# EAGLE board BigMuff (EAGLE 7.1.0)
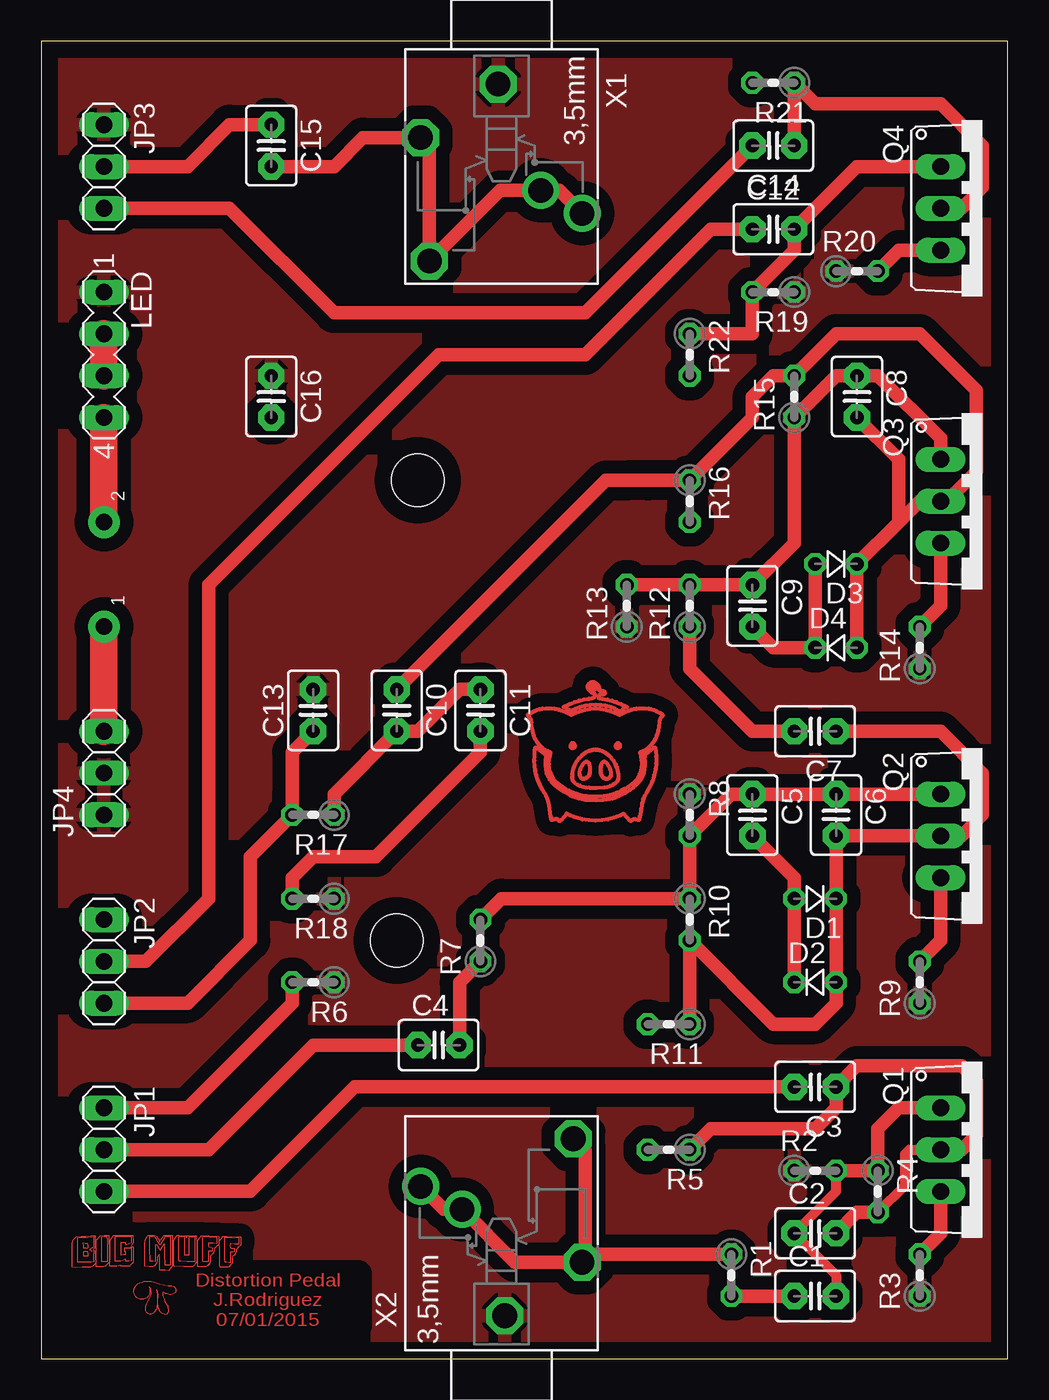
[diagram p1: board, top side]
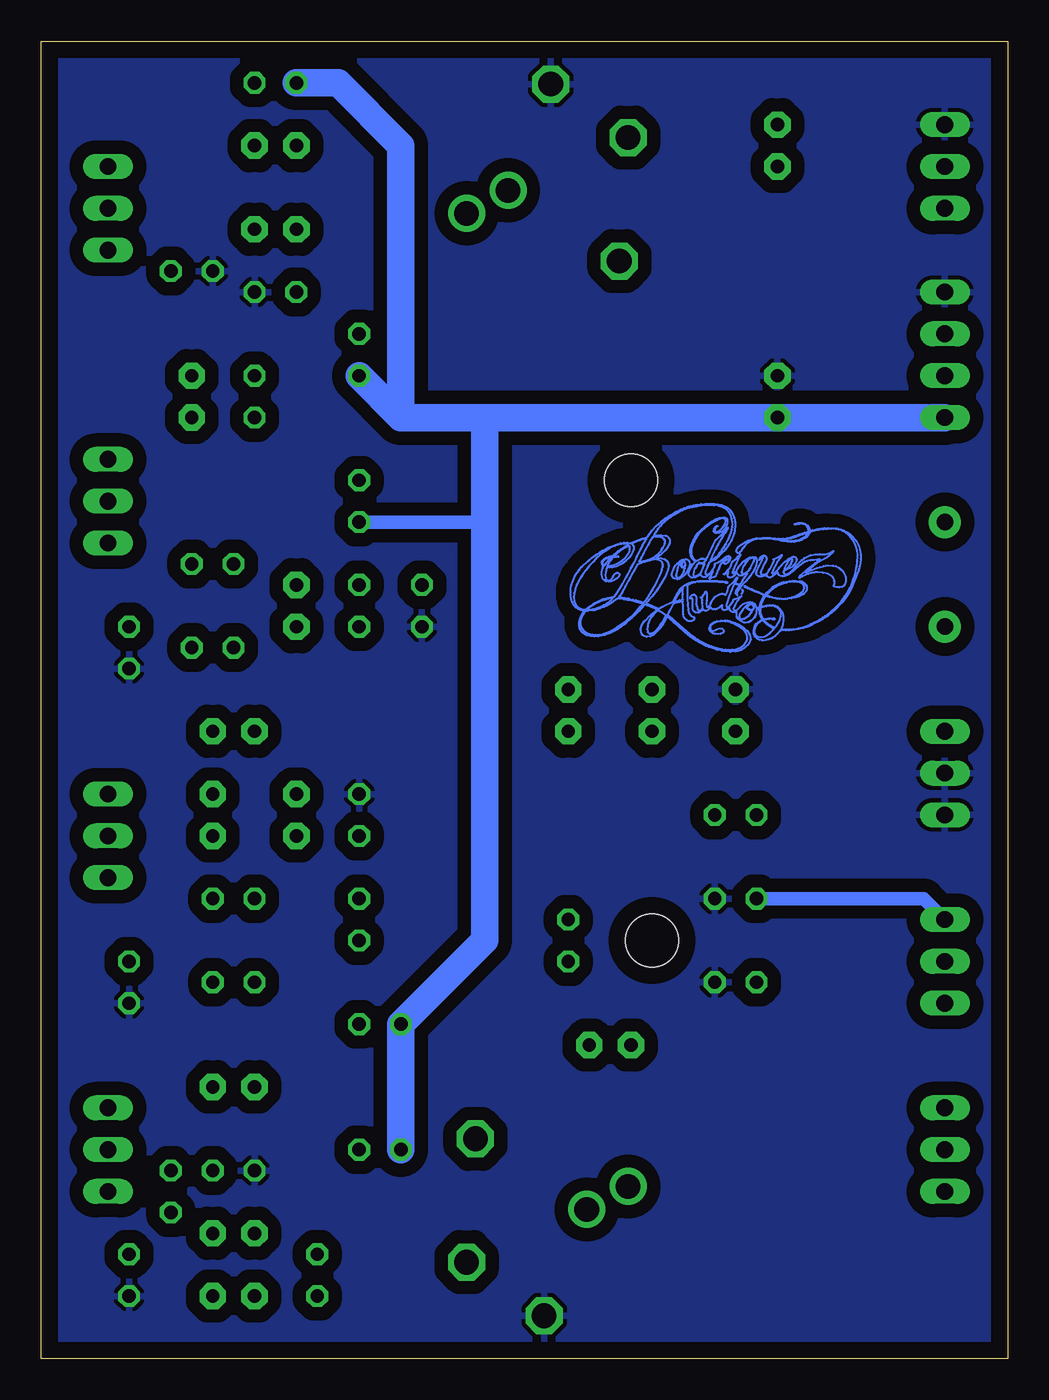
[diagram p2: board, bottom side, seen from below]

Size 58.67 x 80 mm. Coordinates in mm from the lower left corner, seen from the top.
Outline: 0,0 58.67,0 58.67,80 0,80 0,0
Copper layers (1*16): Top 0.035mm / dielectric 1.5mm / Bottom 0.035mm
Design rules "default": minimum track width 10mil, minimum drill 24mil, track to track 8mil, track to pad 8mil, pad to pad 8mil, via to via 8mil, smd to smd 8mil, copper to edge 40mil, drill to drill 8mil, minimum pad ring 10mil, minimum via ring 8mil, stop-mask expansion 4mil, vias tented up to drill 0mil, thermal gap 10mil
Holes 3.2 mm at 22.86,53.34 21.59,25.4

## Footprints (pad centres in the part's own frame; a part is rotated, then mirrored left to right if it is on the bottom)
C2.5-3 = drill 0.813 pad 1.6 octagon: 1 -1.27,0; 2 1.27,0
D-2.5 = drill 0.813 octagon: A 1.27,0; C -1.27,0
1X03 = drill 1.016 long: 1 -2.54,0; 2 0,0; 3 2.54,0
MA04-1 = drill 1.016 long: 1 -3.81,0; 2 -1.27,0; 3 1.27,0; 4 3.81,0
TO220AV = drill 1.016 long: B -2.54,-2.54; C 0,-2.54; E 2.54,-2.54
0204V = drill 0.813 octagon: 1 -1.27,0; 2 1.27,0
MOMENTARY_SWITCH = drill 1 pad 1.93: 1 0,0; 2 6.35,0
PG203J = drill 1.499 octagon: 1 -5.004,-0.203; 4 5.74,-4.369; 5 -1.753,-4.902 | drill 1.499: 2 2.845,4.902; 3 1.448,2.388

## Placement (x,y rotation side)
C1  [C2.5-3]  46.99,3.81 0 top
C2  [C2.5-3]  46.99,7.62 0 top
C3  [C2.5-3]  46.99,16.51 180 top
C4  [C2.5-3]  24.13,19.05 0 top
C5  [C2.5-3]  43.18,33.02 270 top
C6  [C2.5-3]  48.26,33.02 270 top
C7  [C2.5-3]  46.99,38.1 180 top
C8  [C2.5-3]  49.53,58.42 270 top
C9  [C2.5-3]  43.18,45.72 270 top
C10  [C2.5-3]  21.59,39.37 270 top
C11  [C2.5-3]  26.67,39.37 270 top
C12  [C2.5-3]  44.45,68.58 0 top
C13  [C2.5-3]  16.51,39.37 90 top
C14  [C2.5-3]  44.45,73.66 180 top
C15  [C2.5-3]  13.97,73.66 270 top
C16  [C2.5-3]  13.97,58.42 270 top
D1  [D-2.5]  46.99,27.94 180 top
D2  [D-2.5]  46.99,22.86 0 top
D3  [D-2.5]  48.26,48.26 180 top
D4  [D-2.5]  48.26,43.18 0 top
JP1  [1X03]  3.81,12.7 270 top
JP2  [1X03]  3.81,24.13 270 top
JP3  [1X03]  3.81,72.39 270 top
JP4  [1X03]  3.81,35.56 90 top
LED  [MA04-1]  3.81,60.96 270 top
Q1  TIP41C  [TO220AV]  57.15,12.7 270 top
Q2  TIP41C  [TO220AV]  57.15,31.75 270 top
Q3  TIP41C  [TO220AV]  57.15,52.07 270 top
Q4  TIP41C  [TO220AV]  57.15,69.85 270 top
R1  [0204V]  41.91,5.08 270 top
R2  [0204V]  46.99,11.43 0 top
R3  [0204V]  53.34,5.08 90 top
R4  [0204V]  50.8,10.16 270 top
R5  [0204V]  38.1,12.7 180 top
R6  [0204V]  16.51,22.86 180 top
R7  [0204V]  26.67,25.4 90 top
R8  [0204V]  39.37,33.02 270 top
R9  [0204V]  53.34,22.86 90 top
R10  [0204V]  39.37,26.67 270 top
R11  [0204V]  38.1,20.32 180 top
R12  [0204V]  39.37,45.72 90 top
R13  [0204V]  35.56,45.72 90 top
R14  [0204V]  53.34,43.18 90 top
R15  [0204V]  45.72,58.42 90 top
R16  [0204V]  39.37,52.07 270 top
R17  [0204V]  16.51,33.02 180 top
R18  [0204V]  16.51,27.94 180 top
R19  [0204V]  44.45,64.77 180 top
R20  [0204V]  49.53,66.04 0 top
R21  [0204V]  44.45,77.47 180 top
R22  [0204V]  39.37,60.96 270 top
SWITCH  MOMENTARY_SWITCH  [MOMENTARY_SWITCH]  3.81,44.45 90 top
X1  PG203J  [PG203J]  27.94,72.39 270 top
X2  PG203J  [PG203J]  27.94,7.62 90 top

## Tracks (layer width: path | path; a pad name or v marks a point on that pad's centre or on a via)
GND
  pour Bottom (isolate 0.813): -2.54,-1.27 -2.54,81.28 59.69,81.28 59.69,-1.27
  pour Top (isolate 0.813): 0,81.28 59.69,81.28 59.69,-1.27 -1.27,-1.27 -1.27,81.28
N$1
  Top 0.61: R4.2 52.45,10.54 52.45,12.45 52.7,12.7 Q1.C
  Top 0.813: C2.2 49.53,8.89 R4.2 | Q1.C 55.88,12.7 56.77,13.59 56.77,16.89 55.88,17.78 49.53,17.78 C3.1 48.26,15.24 46.99,13.97 40.64,13.97 R5.1
N$2
  Top 0.61: R2.2 48.26,10.16 C2.1 48.26,5.08 C1.2
  Top 0.813: Q1.B 52.07,15.24 50.8,13.97 R4.1 R2.2
N$3
  Top 0.813: R1.2 C1.1
N$4
  Top 1.676: JP4.3 SWITCH.1
N$5
  Top 0.813: R3.2 54.61,7.62 Q1.E
N$6
  Top 0.813: JP1.3 12.7,10.16 19.05,16.51 C3.2
N$7
  Top 0.813: JP1.1 8.89,15.24 15.24,21.59 R6.2
N$8
  Top 0.813: Q4.C 55.88,69.85 57.15,71.12 57.15,73.66 54.61,76.2 46.99,76.2 R21.1 C14.1
N$9
  Top 0.813: JP1.2 10.16,12.7 16.51,19.05 C4.1
N$10
  Top 0.813: C7.1 54.61,38.1 57.15,35.56 57.15,33.02 55.88,31.75 Q2.C C6.2 D1.C D2.A 48.26,21.59 46.99,20.32 44.45,20.32 R10.2 R11.1
N$11
  Top 0.813: C5.2 45.72,29.21 D1.A D2.C
N$12
  Top 0.813: Q2.B C6.1 C5.1 41.91,34.29 R8.2 R10.1 27.94,27.94 R7.2
N$13
  Top 0.813: R9.2 54.61,25.4 Q2.E
N$14
  Top 0.813: R12.1 39.37,41.91 43.18,38.1 C7.2
N$15
  Top 0.813: R7.1 25.4,22.86 C4.2
N$16
  Top 0.813: X1.2 31.44,70.94 X1.3 27.86,70.94 X1.4 23.57,73.61 X1.5 19.53,74.14 17.78,72.39 C15.2
N$17
  Top 0.813: D4.A D3.C 52.07,50.8 | 52.07,50.8 53.34,52.07 Q3.C 54.99,52.07 56.77,53.85 56.77,58.8 53.34,62.23 48.26,62.23 R15.2 44.45,59.69 43.18,58.42 43.18,57.15 R16.1 36.83,53.34 35.56,53.34 34.29,53.34 C10.1 | C8.2 52.07,54.61 52.07,50.8
N$18
  Top 0.813: Q3.B 54.61,55.88 50.8,59.69 C8.1 48.26,59.69 R15.1 45.72,49.53 C9.1 R12.2 R13.2
N$19
  Top 0.813: R14.2 54.61,45.72 Q3.E
N$20
  Top 0.813: D3.A D4.C 44.45,43.18 C9.2
N$21
  Top 0.813: C13.1 15.24,36.83 15.24,34.29 R17.2 12.7,30.48 12.7,25.4 8.89,21.59 JP2.3
N$22
  Bottom 0.127: 16.86,42.92 17.24,42.96 17.35,42.98 17.62,43.05 17.71,43.07 18.17,43.23 18.3,43.29 18.37,43.32 18.43,43.35 18.57,43.42 18.69,43.48 18.89,43.6 19.13,43.75 19.22,43.82 19.44,43.99 19.57,44.1 19.69,44.2 19.93,44.41 20.27,44.72 20.49,44.92 20.55,44.97 20.65,45.06 20.68,45.06 20.7,45.03 20.74,44.96 20.76,44.91 20.78,44.88 20.88,44.71 20.89,44.67 20.92,44.62 21.03,44.47 21.09,44.39 21.13,44.34 21.16,44.3 21.26,44.19 21.38,44.05 21.44,44 21.5,43.95 21.68,43.86 21.92,43.84 22.07,43.88 22.15,43.94 22.21,44.02 22.24,44.12 22.26,44.24 22.26,44.36 22.2,44.54 22.15,44.64 22.05,44.77 22.01,44.82 21.74,45.1 21.64,45.18 21.53,45.28 21.39,45.38 21.3,45.45 21.29,45.46 21.3,45.48 21.47,45.57 21.54,45.61 21.64,45.66 21.75,45.7 21.82,45.73 21.87,45.75 21.89,45.75 21.99,45.79 22.04,45.79 22.07,45.77 22.23,45.59 22.4,45.4 22.53,45.26 22.65,45.14 22.8,44.98 23.17,44.66 23.27,44.59 23.45,44.45 23.5,44.42 23.69,44.3 23.76,44.26 23.81,44.22 23.84,44.21 23.95,44.15 24.11,44.08 24.45,43.94 24.83,43.86 25.08,43.85 25.31,43.87 25.52,43.93 25.67,43.99 25.8,44.09 25.9,44.2 25.97,44.32 26.01,44.52 26.01,44.73 25.98,44.87 25.93,44.99 25.82,45.2 25.72,45.36 25.69,45.4 25.7,45.41 25.75,45.42 25.92,45.46 26.08,45.53 26.23,45.63 26.35,45.76 26.44,45.92 26.5,46.12 26.53,46.32 26.53,46.51 26.52,46.74 26.48,46.98 26.43,47.13 26.38,47.27 26.25,47.56 26.11,47.76 26,47.9 25.84,48.08 25.48,48.43 25.41,48.49 25.23,48.64 25.11,48.73 24.99,48.82 24.73,48.98 24.69,49 24.64,49.03 24.59,49.07 24.36,49.19 24.3,49.23 24.27,49.24 24.12,49.3 23.84,49.41 23.69,49.46 23.49,49.52 23.28,49.55 23.08,49.55 22.91,49.52 22.87,49.51 22.83,49.53 22.74,49.57 22.54,49.66 22.14,49.81 21.9,49.88 21.84,49.92 21.73,50.09 21.7,50.14 21.63,50.23 21.56,50.31 21.32,50.58 21.03,50.83 20.92,50.91 20.81,51 20.75,51.04 20.58,51.16 20.47,51.23 20.27,51.34 20.22,51.37 20.16,51.4 20.09,51.44 19.87,51.55 19.64,51.64 19.47,51.71 19.36,51.74 19.25,51.77 19.11,51.8 19.03,51.82 18.95,51.83 18.88,51.85 18.6,51.89 18.36,51.91 17.79,51.91 17.55,51.87 17.4,51.84 17.26,51.81 17.09,51.72 17,51.66 16.96,51.64 16.86,51.55 16.73,51.36 16.68,51.27 16.66,51.22 16.6,51.06 16.54,50.77 16.54,50.54 16.55,50.37 16.57,50.25 16.6,50.13 16.65,49.96 16.76,49.72 16.81,49.62 16.87,49.51 16.89,49.48 16.95,49.38 17,49.31 17.04,49.26 17.08,49.21 17.14,49.12 17.2,49.05 17.53,48.71 17.63,48.63 17.71,48.57 17.78,48.51 17.95,48.43 18.12,48.34 18.15,48.27 18.19,48.18 18.2,48.15 18.21,48.13 18.29,47.92 18.31,47.86 18.34,47.76 18.34,47.66 18.31,47.63 18.28,47.61 18.17,47.64 18.07,47.71 17.97,47.8 17.87,47.93 17.79,48.06 17.77,48.15 17.77,48.22 17.79,48.25 17.8,48.26 17.77,48.28 17.55,48.37 17.37,48.47 17.25,48.57 17.14,48.67 17.05,48.72 16.97,48.74 16.91,48.74 16.87,48.72 16.85,48.68 16.85,48.61 16.88,48.5 16.98,48.36 17.05,48.29 17.1,48.27 17.17,48.27 17.21,48.29 17.22,48.35 17.2,48.43 17.08,48.53 17.03,48.53 16.99,48.52 16.97,48.52 16.95,48.52 16.89,48.63 16.89,48.66 16.91,48.69 16.98,48.69 17.07,48.65 17.14,48.59 17.25,48.47 17.4,48.27 17.45,48.19 17.49,48.11 17.52,48.03 17.58,47.88 17.67,47.67 17.71,47.53 17.73,47.49 17.79,47.48 17.96,47.42 18.03,47.38 18.08,47.36 18.1,47.35 18.1,47.36 18.05,47.46 18,47.56 17.99,47.58 17.89,47.8 17.9,47.8 17.92,47.77 17.97,47.74 18.04,47.68 18.21,47.54 18.3,47.48 18.38,47.46 18.47,47.46 18.53,47.48 18.59,47.53 18.62,47.6 18.63,47.63 18.69,47.6 18.75,47.55 18.93,47.46 18.97,47.45 19.09,47.43 19.19,47.43 19.24,47.46 19.32,47.53 19.36,47.6 19.36,47.67 19.35,47.76 19.28,47.95 19.24,48.01 19.2,48.08 19.17,48.13 19.2,48.16 19.26,48.17 19.3,48.16 19.32,48.11 19.36,48 19.41,47.9 19.47,47.79 19.52,47.72 19.61,47.61 19.7,47.53 19.81,47.43 19.93,47.36 20.03,47.33 20.22,47.36 20.3,47.42 20.36,47.48 20.38,47.57 20.38,47.69 20.34,47.83 20.28,47.98 20.24,48.06 20.15,48.17 20.07,48.27 19.95,48.38 19.88,48.43 19.79,48.49 19.69,48.53 19.56,48.55 19.45,48.53 19.37,48.47 19.32,48.41 19.29,48.27 19.29,48.23 19.24,48.23 19.2,48.22 19.17,48.2 19.14,48.19 19.11,48.22 19.07,48.26 18.96,48.39 19.02,48.44 19.13,48.56 19.21,48.69 19.24,48.79 19.26,48.98 19.25,49.15 19.23,49.26 19.19,49.42 19.13,49.6 19.09,49.68 19.06,49.75 19.03,49.79 18.95,49.92 18.78,50.14 18.65,50.28 18.55,50.37 18.44,50.46 18.35,50.54 18.28,50.6 18.21,50.67 18.13,50.73 18.05,50.77 17.96,50.83 17.74,50.96 17.71,50.98 17.51,51.05 17.25,51.09 17.16,51.07 17.08,51.02 17.03,50.95 17,50.85 17.02,50.72 17.05,50.63 17.09,50.54 17.19,50.37 17.2,50.34 17.29,50.26 17.4,50.19 17.52,50.14 17.64,50.13 17.7,50.13 17.73,50.14 17.77,50.16 17.81,50.18 17.84,50.23 17.85,50.28 17.82,50.41 17.73,50.53 17.67,50.56 17.62,50.58 17.6,50.58 17.6,50.56 17.66,50.51 17.72,50.46 17.76,50.41 17.78,50.34 17.78,50.29 17.74,50.22 17.66,50.21 17.57,50.24 17.48,50.28 17.35,50.4 17.26,50.51 17.24,50.55 17.15,50.7 17.11,50.88 17.12,50.97 17.14,50.99 17.17,51.01 17.24,51.03 17.31,51.03 17.52,50.98 17.93,50.77 18,50.73 18.12,50.64 18.25,50.54 18.33,50.48 18.4,50.43 18.59,50.25 18.77,50.05 18.98,49.73 19.03,49.63 19.07,49.55 19.14,49.37 19.19,49.17 19.2,49 19.19,48.84 19.11,48.64 19.02,48.54 18.93,48.46 18.9,48.44 18.88,48.44 18.81,48.48 18.69,48.54 18.61,48.58 18.55,48.59 18.46,48.59 18.39,48.55 18.34,48.5 18.31,48.48 18.23,48.65 18.12,48.89 18.1,48.92 18.07,48.98 17.96,49.2 17.89,49.36 17.76,49.66 17.73,49.71 17.7,49.73 17.65,49.77 17.43,49.96 17.38,50.02 17.17,50.25 17.11,50.33 17.05,50.4 17.02,50.43 17,50.45 16.97,50.47 16.96,50.45 16.99,50.41 17.04,50.33 17.09,50.26 17.18,50.13 17.22,50.06 17.3,49.92 17.34,49.86 17.37,49.8 17.4,49.75 17.44,49.69 17.47,49.64 17.48,49.62 17.5,49.57 17.57,49.46 17.62,49.36 17.63,49.34 17.66,49.28 17.7,49.21 17.74,49.12 17.83,48.95 17.91,48.77 17.96,48.67 18,48.56 18.05,48.47 17.99,48.49 17.93,48.53 17.75,48.64 17.54,48.83 17.44,48.97 17.43,48.98 17.39,49.02 17.34,49.08 17.2,49.29 17.11,49.45 16.95,49.75 16.95,49.77 16.92,49.83 16.88,49.92 16.85,49.98 16.78,50.2 16.74,50.32 16.71,50.49 16.7,50.69 16.7,50.83 16.74,50.99 16.81,51.22 16.94,51.43 17.07,51.57 17.14,51.62 17.33,51.71 17.55,51.78 17.82,51.82 18.11,51.83 18.33,51.83 18.78,51.77 18.87,51.75 18.97,51.74 19.04,51.73 19.17,51.7 19.31,51.67 19.51,51.6 19.71,51.52 19.74,51.51 19.97,51.4 20.06,51.34 20.28,51.22 20.32,51.2 20.44,51.12 20.5,51.08 20.65,50.96 20.66,50.95 20.75,50.88 20.8,50.84 20.86,50.79 20.99,50.67 21.09,50.56 21.17,50.47 21.21,50.41 21.24,50.37 21.33,50.24 21.39,50.14 21.47,50 21.47,49.99 21.32,50 21.06,50.01 20.77,49.99 20.7,49.96 20.66,49.94 20.55,49.81 20.53,49.78 20.51,49.74 20.5,49.65 20.52,49.53 20.6,49.36 20.63,49.29 20.81,49.07 21.04,48.84 21.09,48.8 21.15,48.75 21.21,48.71 21.26,48.67 21.3,48.64 21.24,48.64 21.03,48.61 20.83,48.55 20.78,48.53 20.7,48.46 20.62,48.37 20.61,48.33 20.59,48.27 20.57,48.23 20.57,48.15 20.59,48 20.65,47.79 20.68,47.71 20.71,47.64 20.79,47.47 20.84,47.38 20.9,47.29 20.92,47.24 21.02,47.08 21.07,46.99 21.18,46.83 21.22,46.78 21.28,46.7 21.38,46.55 21.48,46.42 21.61,46.26 21.75,46.11 21.86,45.98 21.88,45.95 21.93,45.89 21.86,45.84 21.78,45.8 21.56,45.71 21.5,45.68 21.36,45.62 21.18,45.54 21.14,45.56 21.06,45.61 20.94,45.67 20.73,45.78 20.45,45.9 20.33,45.95 20.29,46 20.15,46.28 20.08,46.4 20.03,46.5 19.97,46.59 19.89,46.71 19.8,46.82 19.69,46.91 19.56,46.99 19.33,47.11 19.18,47.16 19.09,47.17 18.82,47.22 18.69,47.23 18.1,47.24 17.58,47.23 17.27,47.21 17.12,47.19 17.03,47.17 17.01,47.14 17.02,47.1 17.06,47.1 17.14,47.11 17.54,47.16 18.01,47.19 18.38,47.19 18.74,47.18 18.96,47.14 19.16,47.09 19.35,47.01 19.46,46.94 19.44,46.16 19.42,45.76 19.39,45.49 19.38,45.41 19.33,45.25 19.24,45.12 19.17,45.07 19.1,45.05 19.04,45.03 19.02,45.01 19.02,44.98 19.04,44.93 19.08,44.86 19.15,44.81 19.2,44.79 19.28,44.78 19.38,44.79 19.47,44.84 19.57,44.92 19.65,45.05 19.68,45.19 19.7,45.4 19.7,45.68 19.72,45.98 19.91,45.94 20.04,45.91 20.29,45.84 20.35,45.73 20.41,45.62 20.44,45.55 20.47,45.51 20.5,45.45 20.59,45.29 20.63,45.19 20.59,45.13 20.53,45.08 20.42,44.99 20.35,44.93 20.19,44.79 20.15,44.76 20.01,44.64 19.97,44.6 19.91,44.53 19.84,44.47 19.79,44.44 19.73,44.39 19.65,44.32 19.57,44.25 19.49,44.19 19.35,44.07 19.05,43.84 18.99,43.79 18.8,43.66 18.57,43.53 18.5,43.49 18.3,43.39 18.2,43.35 18.09,43.31 17.98,43.27 17.67,43.16 17.44,43.11 17.35,43.09 17.12,43.06 16.71,43.06 16.51,43.08 16.43,43.1 16.37,43.12 16.22,43.18 16.1,43.25 15.99,43.36 15.91,43.47 15.85,43.55 15.8,43.7 15.8,43.84 15.82,43.95 15.86,44.04 15.91,44.13 15.99,44.22 16.2,44.39 16.22,44.4 16.3,44.45 16.4,44.52 16.56,44.6 16.71,44.66 16.83,44.71 17.01,44.75 17.13,44.77 17.31,44.78 17.47,44.78 17.59,44.75 17.72,44.71 17.87,44.65 17.95,44.58 18.01,44.51 18.05,44.43 18.06,44.35 18.04,44.29 18.01,44.24 17.96,44.2 17.91,44.18 17.84,44.19 17.74,44.24 17.58,44.32 17.46,44.35 17.33,44.33 17.25,44.26 17.23,44.2 17.23,44.15 17.27,44.1 17.33,44.05 17.44,44.01 17.58,44 17.75,44.01 17.88,44.04 18,44.12 18.07,44.2 18.09,44.24 18.11,44.32 18.09,44.41 18.06,44.5 17.99,44.6 17.9,44.68 17.79,44.74 17.65,44.79 17.41,44.83 17.18,44.83 17.11,44.82 17.02,44.81 16.9,44.8 16.73,44.75 16.51,44.67 16.32,44.59 16.01,44.38 15.96,44.34 15.82,44.19 15.66,43.95 15.61,43.81 15.61,43.7 15.62,43.59 15.68,43.47 15.77,43.34 15.94,43.18 15.99,43.15 16.16,43.05 16.28,43 16.39,42.97 16.52,42.95 16.82,42.92 16.86,42.92
  Bottom 0.127: 16.86,42.92
N$23
  Top 0.813: R17.1 17.78,34.29 C10.2 22.86,38.1 25.4,40.64 C11.1
N$24
  Top 0.813: JP2.2 6.35,24.13 10.16,27.94 10.16,46.99 24.13,60.96 33.02,60.96 40.64,68.58 C12.1
N$25
  Bottom 0.127: 24.75,43.97 24.57,44 24.46,44.03 24.36,44.07 24.13,44.17 24.03,44.23 23.94,44.28 23.83,44.34 23.71,44.42 23.62,44.48 23.52,44.54 23.44,44.6 23.39,44.63 23.33,44.68 23.23,44.75 23.15,44.82 23.1,44.86 23.04,44.91 22.72,45.19 22.64,45.28 22.55,45.37 22.38,45.55 22.26,45.68 22.16,45.79 22.15,45.83 22.29,45.88 22.62,45.97 22.84,46.03 23,46.06 23.09,46.08 23.18,46.09 23.29,46.11 23.66,46.16 23.71,46.15 23.8,46.08 24.04,45.9 24.11,45.85 24.29,45.75 24.38,45.7 24.44,45.67 24.51,45.65 24.74,45.56 25.05,45.46 25.13,45.44 25.46,45.41 25.55,45.41 25.61,45.39 25.65,45.35 25.72,45.25 25.78,45.17 25.82,45.11 25.85,45.05 25.95,44.79 25.95,44.63 25.93,44.5 25.91,44.45 25.86,44.35 25.77,44.24 25.67,44.15 25.55,44.07 25.4,44.01 25.2,43.97 25.09,43.96 24.75,43.97
N$26
  Top 0.813: Q4.B 49.53,72.39 C12.2 45.72,67.31 R19.2 43.18,62.23 R22.1
N$27
  Top 0.813: R18.2 15.24,29.21 16.51,30.48 20.32,30.48 26.67,36.83 C11.2
  Bottom 0.813: JP2.1 5.08,27.94 R18.2
N$28
  Top 0.813: R20.2 52.07,67.31 Q4.E
N$29
  Top 0.813: JP3.3 11.43,69.85 17.78,63.5 33.02,63.5 C14.2
N$30
  Bottom 0.127: 21.59,44.05 21.47,44.1 21.34,44.21 21.19,44.38 21.14,44.46 21.11,44.5 21.08,44.55 21.02,44.62 20.99,44.68 20.95,44.74 20.91,44.8 20.87,44.87 20.8,45 20.74,45.12 20.74,45.14 20.77,45.16 20.85,45.22 20.92,45.27 21.02,45.33 21.11,45.38 21.17,45.42 21.21,45.43 21.26,45.41 21.32,45.36 21.36,45.33 21.4,45.3 21.44,45.27 21.61,45.06 21.66,44.99 21.7,44.93 21.73,44.86 21.8,44.71 21.84,44.58 21.86,44.48 21.88,44.31 21.85,44.13 21.81,44.07 21.74,44.04 21.68,44.02 21.59,44.05
N$31
  Top 0.813: X2.2 24.44,9.07 X2.3 28.75,5.87 X2.5 | X2.5 33.33,6.35 R1.1 | X2.4 33.02,12.65 33.02,6.35 32.84,6.17 X2.5
N$32
  Top 0.813: JP3.2 8.89,72.39 11.43,74.93 C15.1
N$33
  Top 1.676: LED.3 LED.2
N$34
  Bottom 0.127: 25.55,45.54 25.46,45.62 25.39,45.67 25.16,45.83 25.11,45.85 25.05,45.89 24.98,45.93 24.54,46.13 24.27,46.21 23.97,46.26 23.89,46.28 23.76,46.42 23.53,46.77 23.38,47.05 23.28,47.23 23.2,47.38 23.14,47.48 23.11,47.54 23.08,47.59 23.04,47.67 22.95,47.84 22.94,47.87 22.91,47.91 22.89,47.96 22.87,48 22.81,48.09 22.78,48.15 22.73,48.24 22.68,48.34 22.65,48.4 22.59,48.52 22.51,48.69 22.46,48.78 22.38,48.95 22.37,48.98 22.34,49.03 22.31,49.09 22.29,49.12 22.27,49.16 22.23,49.24 22.21,49.3 22.17,49.36 22.13,49.42 22.07,49.54 22.04,49.59 22.02,49.64 21.99,49.67 21.96,49.73 21.94,49.78 21.95,49.79 22.32,49.69 22.75,49.5 22.79,49.47 22.75,49.4 22.7,49.31 22.69,49.24 22.7,49.14 22.72,49.07 22.76,48.99 22.85,48.81 22.96,48.67 23.02,48.6 23.18,48.44 23.26,48.38 23.32,48.33 23.38,48.29 23.46,48.24 23.52,48.22 23.67,48.14 23.78,48.1 23.92,48.07 24.02,48.05 24.17,48.06 24.32,48.06 24.34,48 24.39,47.78 24.42,47.59 24.39,47.37 24.39,47.34 24.36,47.3 24.3,47.27 24.23,47.25 24.19,47.24 24.14,47.26 24.07,47.32 24.01,47.39 23.96,47.46 23.91,47.55 23.86,47.63 23.8,47.69 23.75,47.72 23.69,47.73 23.6,47.69 23.56,47.66 23.55,47.63 23.61,47.49 23.71,47.39 23.85,47.3 24.04,47.22 24.12,47.2 24.23,47.19 24.37,47.2 24.4,47.21 24.49,47.26 24.57,47.35 24.62,47.48 24.65,47.62 24.64,47.76 24.61,47.91 24.56,48.02 24.51,48.13 24.54,48.16 24.62,48.25 24.64,48.35 24.62,48.44 24.56,48.51 24.5,48.56 24.34,48.65 24.21,48.7 24.07,48.73 23.98,48.74 23.95,48.78 23.7,48.99 23.64,49.03 23.58,49.08 23.47,49.16 23.32,49.26 23.18,49.35 23.1,49.4 23.06,49.42 23.05,49.45 23.1,49.47 23.3,49.48 23.44,49.48 23.53,49.46 23.85,49.36 24.12,49.23 24.19,49.19 24.43,49.04 24.61,48.91 24.75,48.79 24.8,48.74 24.87,48.69 24.97,48.59 25.18,48.38 25.27,48.28 25.34,48.2 25.39,48.14 25.62,47.87 25.67,47.8 25.7,47.77 25.73,47.73 25.75,47.69 25.79,47.64 25.89,47.48 25.97,47.35 26,47.31 26.03,47.25 26.13,47.04 26.16,46.99 26.24,46.76 26.26,46.69 26.29,46.57 26.31,46.47 26.34,46.25 26.32,45.98 26.26,45.85 26.24,45.8 26.15,45.7 26.08,45.63 26,45.58 25.88,45.53 25.72,45.49 25.62,45.49 25.55,45.54
  Bottom 0.127: 25.55,45.54
N$35
  Bottom 0.127: 25.17,45.52 24.82,45.62 24.52,45.76 24.31,45.88 24.21,45.95 24.09,46.05 23.99,46.15 24,46.16 24.34,46.11 24.42,46.09 24.48,46.07 24.5,46.07 24.61,46.04 24.7,46 24.83,45.94 25.02,45.85 25.17,45.76 25.28,45.69 25.44,45.57 25.51,45.5 25.49,45.49 25.41,45.48 25.31,45.49 25.17,45.52
N$36
  Bottom 0.127: 22.05,45.94 22.01,45.99 21.92,46.12 21.86,46.21 21.77,46.33 21.7,46.44 21.67,46.48 21.65,46.52 21.57,46.66 21.48,46.81 21.44,46.9 21.4,46.96 21.29,47.19 21.12,47.55 21.1,47.61 21.07,47.67 21.04,47.74 21.01,47.84 20.99,47.89 20.93,48.08 20.92,48.18 20.93,48.23 20.96,48.32 20.99,48.38 21.03,48.44 21.2,48.52 21.27,48.54 21.47,48.54 21.56,48.52 21.63,48.5 21.71,48.48 21.78,48.46 21.85,48.44 21.96,48.41 22.03,48.39 22.22,48.32 22.32,48.28 22.45,48.24 22.51,48.18 22.56,48.07 22.6,47.99 22.63,47.93 22.72,47.78 22.76,47.7 22.8,47.62 22.84,47.55 22.88,47.48 22.91,47.43 22.95,47.37 23.02,47.23 23.21,46.89 23.31,46.7 23.33,46.65 23.37,46.6 23.47,46.44 23.54,46.34 23.59,46.28 23.6,46.26 23.57,46.24 23.52,46.23 23.47,46.23 23.4,46.22 23.24,46.2 23.07,46.17 22.99,46.15 22.73,46.1 22.56,46.06 22.41,46.02 22.31,45.99 22.23,45.96 22.15,45.93 22.08,45.91 22.05,45.94 | 22.05,45.94
N$37
  Bottom 0.127: 20.1,46.01 19.9,46.06 19.78,46.09 19.72,46.12 19.71,46.44 19.71,46.77 19.75,46.75 19.83,46.68 19.91,46.58 19.98,46.46 20.03,46.37 20.06,46.32 20.09,46.26 20.13,46.2 20.16,46.15 20.2,46.08 20.23,46.01 20.24,45.99 20.23,45.98 20.1,46.01 | 20.1,46.01
N$38
  Bottom 0.127: 19.92,47.44 19.75,47.61 19.65,47.78 19.59,47.99 19.59,48.06 19.6,48.07 19.62,48.06 19.72,48.04 19.77,48.06 19.79,48.08 19.82,48.12 19.83,48.18 19.81,48.28 19.78,48.36 19.74,48.43 19.84,48.37 19.9,48.31 19.95,48.24 20.02,48.06 20.03,48.03 20.05,47.95 20.07,47.88 20.11,47.68 20.12,47.59 20.12,47.52 20.09,47.46 20.06,47.44 20,47.42 19.92,47.44
N$39
  Bottom 0.127: 18.92,47.53 18.79,47.59 18.66,47.68 18.62,47.72 18.6,47.77 18.57,47.85 18.52,47.97 18.44,48.14 18.4,48.23 18.4,48.25 18.51,48.26 18.75,48.28 18.79,48.28 18.83,48.24 18.88,48.15 18.98,48.01 19.02,47.93 19.04,47.82 19.07,47.61 19.06,47.55 19.03,47.52 18.99,47.51 18.92,47.53 | 18.92,47.53
N$40
  Bottom 0.127: 19.65,48.11 19.62,48.12 19.58,48.14 19.55,48.17 19.56,48.22 19.57,48.3 19.59,48.36 19.6,48.41 19.62,48.42 19.65,48.42 19.71,48.37 19.74,48.33 19.78,48.26 19.78,48.18 19.77,48.13 19.74,48.11 19.69,48.1 19.65,48.11 | 19.65,48.11
N$41
  Bottom 0.127: 24.08,48.16 23.87,48.2 23.68,48.29 23.6,48.34 23.39,48.48 23.21,48.64 23.15,48.71 23.13,48.74 23.08,48.81 23.01,48.92 22.95,49.05 22.93,49.16 22.93,49.28 22.96,49.36 22.99,49.38 23.02,49.36 23.1,49.32 23.22,49.26 23.27,49.22 23.6,49 23.68,48.92 23.74,48.88 23.77,48.85 23.83,48.81 23.86,48.76 23.79,48.75 23.66,48.73 23.63,48.71 23.62,48.69 23.75,48.68 23.92,48.67 23.96,48.66 24,48.63 24.13,48.46 24.16,48.43 24.19,48.36 24.25,48.25 24.28,48.18 24.27,48.15 24.08,48.16 | 24.08,48.16
N$42
  Bottom 0.127: 24.45,48.21 24.42,48.24 24.39,48.29 24.16,48.57 24.09,48.65 24.18,48.64 24.27,48.62 24.48,48.51 24.57,48.42 24.61,48.34 24.58,48.26 24.51,48.2 24.47,48.19 24.45,48.21
N$43
  Bottom 0.127: 18.42,48.33 18.4,48.36 18.41,48.41 | 18.73,48.35 18.72,48.34 18.69,48.33 18.54,48.32 18.42,48.33 | 18.42,48.33
N$44
  Bottom 0.127: 22.26,48.4 22.18,48.42 22.12,48.44 21.76,48.53 21.59,48.59 21.47,48.65 21.38,48.71 21.21,48.86 21.08,49 21.05,49.04 21.01,49.09 20.98,49.14 20.93,49.23 20.91,49.27 20.82,49.45 20.8,49.51 20.79,49.6 20.81,49.71 20.87,49.8 20.97,49.85 21.09,49.89 21.22,49.9 21.36,49.9 21.51,49.88 21.57,49.87 21.6,49.82 21.64,49.75 21.67,49.7 21.69,49.66 21.73,49.6 21.77,49.54 21.84,49.4 21.94,49.21 21.97,49.16 21.98,49.12 22.09,48.93 22.12,48.86 22.15,48.82 22.18,48.76 22.21,48.7 22.24,48.65 22.3,48.55 22.34,48.45 22.37,48.39 22.35,48.38 22.26,48.4 | 22.26,48.4
N$45
  Bottom 0.127: 14.91,43.62 15.06,43.65 15.19,43.71 15.36,43.87 15.4,43.98 15.42,44.11 15.42,44.22 15.39,44.36 15.35,44.49 15.25,44.62 15.12,44.74 14.99,44.82 14.89,44.88 14.91,44.93 14.96,45.02 14.99,45.08 15.04,45.23 15.06,45.48 15.07,45.57 15.15,45.55 15.2,45.53 15.23,45.51 15.24,45.41 15.26,45.3 15.29,45.19 15.33,45.09 15.39,45 15.53,44.83 15.58,44.8 15.67,44.74 15.76,44.71 15.89,44.7 15.98,44.7 16.04,44.72 16.24,44.82 16.4,44.97 16.43,45.05 16.46,45.16 16.46,45.28 16.45,45.34 16.48,45.35 16.55,45.34 16.68,45.34 16.8,45.39 16.86,45.45 16.88,45.54 16.88,45.59 16.93,45.56 17.04,45.5 17.16,45.46 17.24,45.46 17.3,45.5 17.33,45.56 17.32,45.67 17.31,45.75 17.33,45.77 17.42,45.69 17.52,45.6 17.56,45.58 17.64,45.53 17.74,45.5 17.84,45.5 17.92,45.52 17.99,45.56 18.02,45.61 18.04,45.64 18.09,45.58 18.2,45.46 18.27,45.42 18.35,45.41 18.41,45.43 18.45,45.47 18.48,45.5 18.49,45.49 18.67,45.33 18.76,45.31 18.85,45.3 18.94,45.32 19,45.34 19.04,45.38 19.09,45.44 19.12,45.51 19.13,45.72 19.12,45.98 19.13,46.12 19.15,46.17 19.18,46.19 19.24,46.16 19.27,46.15 19.28,46.18 19.25,46.26 19.2,46.34 19.14,46.38 19.07,46.4 19.02,46.4 18.97,46.37 18.93,46.33 18.9,46.28 18.89,46.2 18.9,45.98 18.9,45.84 18.88,45.72 18.82,45.52 18.79,45.47 18.75,45.44 18.7,45.42 18.64,45.44 18.6,45.47 18.54,45.55 18.51,45.6 18.52,45.7 18.52,45.87 18.53,46.08 18.54,46.22 18.56,46.23 18.59,46.21 18.63,46.2 18.64,46.21 18.61,46.24 18.5,46.31 18.43,46.39 18.41,46.43 18.37,46.49 18.32,46.58 18.3,46.58 18.28,46.56 18.27,46.5 18.26,46.4 18.28,46.04 18.28,45.84 18.26,45.67 18.22,45.63 18.17,45.65 18.07,45.76 18.04,45.81 18.01,45.87 17.97,45.95 17.93,46.03 17.92,46.06 17.87,46.13 17.74,46.28 17.71,46.3 17.58,46.37 17.45,46.43 17.33,46.46 17.23,46.44 17.15,46.41 17.11,46.38 17.03,46.56 16.99,46.66 16.97,46.78 16.96,46.86 16.91,46.9 16.65,47.15 16.57,47.25 16.4,47.45 16.4,47.4 16.46,47.29 16.63,46.96 16.7,46.79 16.79,46.59 16.83,46.47 16.92,46.23 17.02,45.94 17.05,45.83 17.07,45.73 17.04,45.63 17,45.62 16.96,45.63 16.83,45.76 16.72,45.91 16.69,45.95 16.68,45.98 16.66,46.03 16.65,46.07 16.65,46.1 16.57,46.13 16.28,46.25
  Bottom 0.127: 16.15,46.31 16.18,46.28 16.23,46.24 16.28,46.2 16.4,46.02 16.43,45.97 16.54,45.78 16.64,45.57 16.64,45.52 16.62,45.47 16.59,45.45 16.54,45.44 16.42,45.48 16.35,45.55 16.21,45.71 16.04,45.83 15.77,45.93 15.63,45.94 15.51,45.92 15.39,45.84 15.31,45.76 15.28,45.65 15.24,45.57 15.06,45.63 15.04,45.7 14.98,45.93 14.89,46.11 14.87,46.15 14.77,46.3 14.76,46.33 14.85,46.38 15.36,46.59 15.48,46.65 15.78,46.77 15.92,46.83 15.97,46.87 15.96,46.91 15.92,46.92 15.83,46.87 15.69,46.8 15.58,46.75 15.53,46.73 15.35,46.64 15.24,46.59 15.18,46.56 15.14,46.55 15.06,46.52 14.96,46.48 14.82,46.42 14.73,46.38 14.59,46.53 14.45,46.68 14.29,46.82 14.26,46.85 14.24,46.88 14.2,46.9 13.84,47.09 13.72,47.12 13.61,47.15 13.49,47.17 13.25,47.21 13.09,47.23 12.85,47.23 12.6,47.22 12.51,47.2 12.44,47.17 12.3,47.07 12.26,47.01 12.2,46.91 12.18,46.77 12.19,46.68 12.22,46.6 12.37,46.45 12.43,46.41 12.59,46.33 12.66,46.29 12.88,46.22 13.11,46.16 13.35,46.13 13.47,46.12 13.85,46.13 13.96,46.15 14.07,46.16 14.17,46.18 14.46,46.25 14.69,46.31 14.77,46.21 14.96,45.83 14.99,45.66 14.89,45.68 14.61,45.74 14.43,45.76 14.25,45.75 14.11,45.72 14,45.68 13.9,45.61 13.81,45.51 13.73,45.38 13.66,45.24 13.63,45.13 13.61,45 13.61,44.8 13.64,44.63 13.65,44.57 13.71,44.38 13.73,44.31 13.45,44.28 13.13,44.29 13,44.3 12.74,44.34 12.61,44.37 12.25,44.48 11.96,44.61 11.8,44.69 11.42,44.88 11.22,44.99 11.14,45.05 11.07,45.09 10.97,45.16 10.91,45.21 10.83,45.27 10.77,45.31 10.73,45.34 10.42,45.62 10.18,45.89 10.11,45.98 9.99,46.14 9.95,46.19 9.91,46.25 9.85,46.33 9.8,46.4 9.77,46.46 9.6,46.74 9.56,46.82 9.49,46.95 9.33,47.41 9.29,47.54 9.23,47.75 9.17,48.03 9.15,48.15 9.13,48.29 9.11,48.44 9.11,48.69 9.11,48.88 9.13,49.05 9.22,49.37 9.24,49.41 9.38,49.69 9.54,49.9 9.72,50.06 9.79,50.13 9.83,50.16 9.86,50.19 9.93,50.23 10.01,50.27 10.28,50.35 10.45,50.38 10.71,50.38 10.91,50.38 10.98,50.38 11.07,50.37 11.2,50.35 11.43,50.33 11.52,50.31 11.71,50.28 11.91,50.22 12.02,50.18 12.07,50.09 12.1,50.03 12.22,49.9 12.28,49.85 12.47,49.73 12.65,49.66 12.85,49.62 12.96,49.61 13.16,49.6 13.4,49.61 13.61,49.65 13.72,49.67 13.77,49.68 14.02,49.73 14.13,49.76 14.2,49.77 14.28,49.78 14.44,49.8 14.69,49.8 14.93,49.79 15.02,49.78 15.21,49.76 15.46,49.7 15.67,49.61 15.82,49.5 15.97,49.36 16.08,49.23 16.15,49.1 16.18,49.04 16.25,48.97 16.3,48.92 16.35,48.92 16.41,48.93 16.44,48.97 16.46,49.05 16.45,49.11 16.45,49.13 16.42,49.19 16.36,49.28 16.31,49.33 16.23,49.4 15.99,49.55 15.93,49.59 15.73,49.69 15.5,49.77 15.29,49.82 15.23,49.83 14.86,49.85 14.4,49.84 14.08,49.81 13.91,49.8 13.65,49.8 13.38,49.83 13.07,49.91 13.04,49.92 12.95,49.95 12.75,50.01 12.68,50.04 12.59,50.07 12.49,50.1 12.34,50.16 12.12,50.23 12.08,50.26 12.09,50.37 12.13,50.49 12.2,50.57 12.29,50.64 12.41,50.68 12.53,50.7 12.64,50.7 12.71,50.69 12.85,50.66 12.91,50.66 12.94,50.67 12.93,50.68 12.89,50.69 12.8,50.73 12.7,50.75 12.56,50.76 12.47,50.74 12.39,50.72 12.27,50.67 12.15,50.6 12.06,50.48 12.02,50.33 12.02,50.28 11.96,50.27 11.83,50.31 11.48,50.38 11.3,50.41 11.13,50.44 10.9,50.44 10.41,50.41 10.31,50.4 10.11,50.35 9.93,50.29 9.73,50.19 9.58,50.08 9.48,50 9.19,49.67 9.15,49.6 9.04,49.37 8.96,49.13 8.92,48.82 8.92,48.56 8.94,48.32 8.98,48.11 9.01,48 9.04,47.89 9.11,47.65 9.27,47.27 9.3,47.2 9.36,47.05 9.44,46.89 9.47,46.82 9.49,46.79 9.51,46.75 9.62,46.55 9.67,46.46 9.74,46.35 9.86,46.17 9.95,46.05 10.07,45.91 10.12,45.85 10.44,45.51 10.67,45.31 10.7,45.29 10.88,45.14 10.96,45.08 11.25,44.89 11.38,44.82 11.88,44.57 11.96,44.53 12.03,44.5 12.08,44.48 12.1,44.47 12.19,44.44 12.41,44.37 12.69,44.3 12.9,44.27 13.1,44.24 13.26,44.23 13.45,44.23 13.65,44.24 13.74,44.25 13.78,44.25 13.84,44.18 13.97,44.01 14.1,43.89 14.16,43.85 14.28,43.77 14.34,43.74 14.41,43.72 14.51,43.67 14.68,43.63 14.81,43.61 14.91,43.62
  Bottom 0.127: 14.91,43.62
N$46
  Bottom 0.127: 14.83,43.84 14.7,43.88 14.6,43.94 14.53,43.99 14.41,44.09 14.25,44.24 14.18,44.31 14.19,44.33 14.21,44.35 14.31,44.4 14.41,44.46 14.61,44.59 14.81,44.79 14.85,44.84 14.91,44.82 15.02,44.76 15.22,44.59 15.29,44.49 15.33,44.4 15.34,44.35 15.38,44.17 15.37,44.07 15.33,43.97 15.26,43.89 15.19,43.85 15.14,43.83 15.09,43.83 14.97,43.82 14.83,43.84
N$47
  Bottom 0.127: 14.11,44.41 14.02,44.52 13.97,44.6 13.94,44.65 13.89,44.73 13.85,44.81 13.83,44.85 13.76,45.08 13.74,45.24 13.74,45.33 13.78,45.39 13.86,45.5 13.94,45.58 14.14,45.69 14.32,45.72 14.48,45.72 14.65,45.69 14.86,45.64 14.96,45.62 14.99,45.6 15.01,45.58 15.01,45.45 15.01,45.31 14.99,45.23 14.96,45.14 14.86,44.94 14.84,44.91 14.8,44.91 14.69,44.93 14.54,44.95 14.31,44.96 14.17,44.96 14.15,44.95 14.13,44.91 14.15,44.89 14.2,44.88 14.26,44.9 14.3,44.92 14.47,44.91 14.64,44.9 14.75,44.88 14.77,44.87 14.78,44.84 14.77,44.81 14.71,44.76 14.64,44.7 14.59,44.66 14.39,44.53 14.37,44.51 14.2,44.43 14.16,44.41 14.11,44.41
N$48
  Bottom 0.127: 16.1,44.91 16,44.94 15.91,44.99 15.7,45.15 15.57,45.29 15.5,45.39 15.58,45.42 15.69,45.45 15.79,45.51 15.82,45.57 15.84,45.63 15.82,45.69 15.78,45.75 15.76,45.79 15.83,45.75 16.04,45.55 16.24,45.27 16.28,45.16 16.29,45.06 16.27,44.98 16.23,44.94 16.18,44.91 16.14,44.9 16.1,44.91 | 16.1,44.91
N$49
  Bottom 0.127: 15.47,45.51 15.42,45.52 15.4,45.56 15.39,45.6 15.4,45.64 15.43,45.73 15.47,45.79 15.52,45.81 15.6,45.81 15.68,45.78 15.75,45.72 15.79,45.67 15.79,45.61 15.75,45.55 15.68,45.51 15.53,45.49 15.47,45.51
N$50
  Bottom 0.127: 13.47,46.16 13.26,46.19 13.11,46.24 13.08,46.25 12.82,46.33 12.76,46.36 12.56,46.5 12.42,46.63 12.34,46.78 12.34,46.89 12.37,46.97 12.41,47.02 12.45,47.05 12.54,47.1 12.68,47.15 12.78,47.18 12.96,47.18 13.2,47.17 13.43,47.12 13.8,47.01 14.06,46.87 14.2,46.79 14.41,46.61 14.56,46.45 14.65,46.36 14.63,46.34 14.57,46.32 14.49,46.3 14.41,46.28 14.31,46.25 14.06,46.19 13.85,46.17 13.74,46.16 13.47,46.16 | 13.47,46.16
N$51
  Bottom 0.127: 13.02,49.66 12.9,49.68 12.83,49.7 12.58,49.77 12.49,49.81 12.31,49.91 12.27,49.93 12.22,49.97 12.16,50.06 12.12,50.13 12.14,50.15 12.18,50.13 12.21,50.12 12.29,50.1 12.43,50.06 12.64,49.98 12.84,49.91 12.86,49.9 12.99,49.86 13.13,49.82 13.23,49.8 13.35,49.77 13.42,49.76 13.5,49.74 13.6,49.73 13.64,49.71 13.63,49.7 13.4,49.67 13.31,49.66 13.02,49.66
N$52
  Bottom 0.127: 16.12,46.72 16.08,46.66 16.08,46.58 16.11,46.5 16.16,46.44
N$53
  Bottom 0.127: 16.02,47.68 15.8,47.8 15.74,47.84 15.68,47.9 15.61,48 15.41,48.42 15.38,48.52 15.37,48.59 15.42,48.62 15.51,48.63 15.62,48.6 15.73,48.54 15.82,48.46 15.9,48.34 16.01,48.16 16.02,48.14 16.04,48.1 16.06,48.05 16.15,47.81 16.15,47.74 16.12,47.69 16.07,47.66 16.02,47.68
N$54
  Bottom 0.127: 10.39,46.85 10.51,46.88 10.56,46.92 10.56,46.94 10.51,47.04 10.5,47.13 10.51,47.22 10.53,47.3 10.59,47.42 10.64,47.49 10.72,47.55 10.91,47.66 11.2,47.72 11.55,47.76 11.72,47.74 11.77,47.74 11.82,47.73 11.89,47.72 12.08,47.66 12.26,47.6 12.36,47.55 12.46,47.51 12.54,47.47 12.6,47.43 12.63,47.42 12.66,47.43 12.63,47.47 12.54,47.57 12.24,47.85 12.14,47.95 12.04,48.04 11.9,48.15 11.68,48.31 11.52,48.43 11.39,48.53 11.41,48.54 11.46,48.53 11.59,48.51 11.76,48.49 11.98,48.48 12.14,48.45 12.31,48.39 12.39,48.34 12.46,48.29 12.57,48.2 12.62,48.17 12.94,47.91 13.01,47.85 13.08,47.79 13.24,47.66 13.37,47.59 13.52,47.53 13.67,47.5 13.8,47.53 13.88,47.58 13.92,47.64 13.94,47.71 13.95,47.76 14.11,47.63 14.26,47.5 14.4,47.45 14.45,47.44 14.5,47.45 14.58,47.49 14.61,47.56 14.62,47.58 14.66,47.57 14.92,47.5 15.01,47.49 15.09,47.5 15.16,47.53 15.22,47.59 15.25,47.63 15.26,47.7 15.25,47.76 15.22,47.86 15.15,48.04 15.08,48.16 14.99,48.33 14.93,48.44 14.9,48.49 14.86,48.61 14.87,48.64 14.9,48.65 14.94,48.64 14.98,48.59 15.03,48.54 15.06,48.51 15.08,48.49 15.05,48.59 15,48.68 14.92,48.73 14.81,48.76 14.75,48.77 14.71,48.74 14.66,48.7 14.64,48.66 14.63,48.59 14.65,48.49 14.7,48.39 14.72,48.35 14.76,48.27 14.97,47.84 14.99,47.73 14.98,47.66 14.96,47.62 14.91,47.61 14.81,47.62 14.68,47.65 14.61,47.66 14.56,47.74 14.5,47.85 14.45,47.93 14.42,47.98 14.33,48.16 14.26,48.28 14.23,48.34 14.19,48.43 14.17,48.5 14.22,48.51 14.24,48.52 14.22,48.54 14.18,48.55 14.15,48.57 13.95,48.66 13.82,48.74 13.77,48.77 13.73,48.8 13.7,48.81 13.71,48.8 13.78,48.69 13.83,48.62 13.91,48.49 13.98,48.37 14.1,48.15 14.16,48.04 14.19,47.99 14.23,47.89 14.29,47.74 14.3,47.7 14.28,47.68 14.24,47.67 14.17,47.69 14.13,47.72 13.88,47.97 13.82,48.06 13.77,48.13 13.74,48.18 13.57,48.35 13.52,48.4 13.35,48.53 13.27,48.59 13.18,48.64 13.08,48.68 13,48.7 12.92,48.69 12.86,48.65 12.82,48.6 12.81,48.52 12.82,48.44 12.88,48.32 12.99,48.19 13.1,48.07 13.22,48 13.46,47.9 13.57,47.86 13.59,47.81 13.59,47.75 13.57,47.69 13.54,47.64 13.48,47.62 13.42,47.62 13.33,47.66 13.2,47.75 13.15,47.8 12.82,48.14 12.69,48.3 12.62,48.38 12.5,48.5 12.34,48.61 12.03,48.76 11.92,48.8 11.68,48.84 11.38,48.85 11.05,48.85 10.94,48.87 10.85,48.91 10.76,48.95 10.68,48.99 10.57,49.05 10.57,49.02 10.66,48.92 10.83,48.76 10.99,48.65 11.11,48.58 11.35,48.45 11.5,48.37 11.6,48.3 11.69,48.24 11.75,48.19 11.83,48.12 11.9,48.06 12.02,47.95 12.22,47.77 12.24,47.75 12.22,47.75 12.12,47.8 12.01,47.85 11.93,47.89 11.54,48.03 11.4,48.07 11.17,48.13 11.03,48.15 10.89,48.17 10.61,48.16 10.43,48.12 10.28,48.06 10.2,48.01 10.14,47.95 10.09,47.91 10.02,47.83 9.97,47.77 9.94,47.71 9.9,47.66 9.83,47.47 9.81,47.41 9.81,47.3 9.83,47.14 9.88,47.02 9.94,46.95 9.99,46.89 10.05,46.87 10.21,46.83 10.39,46.85
  Bottom 0.127: 10.39,46.85
N$55
  Bottom 0.127: 13.47,47.95 13.32,48.04 13.2,48.18 13.16,48.24 13.12,48.32 13.07,48.42 13.07,48.52 13.09,48.55 13.11,48.57 13.16,48.56 13.23,48.53 13.33,48.43 13.45,48.2 13.55,47.96 13.54,47.94 13.47,47.95 | 13.47,47.95
N$56
  Bottom 0.127: 16.4,47 16.49,47.04 16.49,47.05 16.47,47.06 16.38,47.05 16.29,47.03 16.27,47 16.29,46.99 16.4,47 | 16.4,47
N$57
  Bottom 0.127: 17.23,47.64 17.11,47.73 16.94,47.93 16.88,48.01 16.8,48.13 16.71,48.39 16.7,48.41 16.69,48.42 16.55,48.5 16.45,48.59 16.34,48.72 16.23,48.85 16.22,48.83 16.24,48.8 16.31,48.65 16.34,48.57 16.38,48.49 16.47,48.3 16.59,48.03 16.63,47.94 16.69,47.78 16.69,47.71 16.64,47.69 16.6,47.71 16.57,47.75 16.55,47.76 16.53,47.76 16.48,47.79 16.45,47.82 16.43,47.88 16.4,47.95 16.38,47.98 16.28,48.12 16.24,48.18 16.02,48.42 15.82,48.57 15.64,48.66 15.46,48.7 15.32,48.68 15.28,48.65 15.25,48.61 15.22,48.44 15.27,48.17 15.35,47.97 15.43,47.81 15.48,47.73 15.55,47.63 15.59,47.57 15.93,47.18 16.23,46.85 16.39,46.63 16.43,46.56 16.43,46.49 16.43,46.43
N$58
  Bottom 0.127: 17.19,47.62 16.97,47.79 16.95,47.8 16.96,47.74 16.99,47.64 16.99,47.56 16.99,47.51 16.96,47.48 16.9,47.44 16.83,47.43 16.73,47.45 16.61,47.54 16.56,47.6 16.53,47.64 16.45,47.73 16.41,47.68 16.36,47.61 16.3,47.57 16.24,47.55 16.17,47.55 16.09,47.57 15.85,47.68 15.82,47.7 15.8,47.69 15.82,47.66 15.86,47.59 15.92,47.5 16.1,47.21 16.18,47.08 16.33,46.85 16.41,46.73 16.46,46.64 16.51,46.5 16.49,46.44 16.44,46.39 | 16.4,46.36 16.44,46.39 | 16.44,46.39
N$59
  Top 0.254: 31.39,32.72 31.34,32.76 31.3,32.78 31.24,32.77 31.17,32.74 31.06,32.71 31,32.71 30.95,32.92 30.87,33.38 30.8,33.75 30.74,33.98 30.66,34.16 30.53,34.37 30.38,34.62 30.26,34.88 30.15,35.15 30.06,35.44 30,35.72 29.96,36.02 29.95,36.32 29.95,36.62 29.98,36.96 30.01,37.13 30.04,37.13 30.09,37.11 30.24,36.99 30.42,36.84 30.56,36.75 30.62,36.72 30.65,36.68 30.65,36.62 30.64,36.53 30.61,36.3 30.61,36.03 30.64,35.76 30.69,35.54 30.77,35.36 30.87,35.18 31,35.02 31.15,34.85 31.34,34.7 31.55,34.55 31.79,34.4 32.07,34.26 32.26,34.17 32.45,34.1 32.63,34.04 32.82,33.99 33.02,33.96 33.23,33.93 33.69,33.92 34.13,33.94 34.33,33.96 34.52,34 34.71,34.05 34.89,34.11 35.07,34.18 35.25,34.26 35.51,34.4 35.74,34.55 35.95,34.7 36.13,34.86 36.29,35.02 36.42,35.19 36.52,35.36 36.59,35.53 36.64,35.75 36.67,36.02 36.67,36.3 36.65,36.53 36.63,36.62 36.64,36.68 36.67,36.72 36.73,36.75 36.87,36.84 37.05,36.99 37.2,37.11 37.25,37.13 37.28,37.13 37.3,37.05 37.31,36.93 37.33,36.56 37.33,36.15 37.3,35.81 37.27,35.63 37.22,35.44 37.09,35.05 36.93,34.68 36.84,34.51 36.74,34.35 36.62,34.16 36.54,33.98 36.48,33.75 36.42,33.38 36.33,32.92 36.29,32.71 36.23,32.71 36.12,32.74 36.05,32.77 35.99,32.77 35.94,32.75 35.88,32.71 35.82,32.66 35.8,32.66 35.77,32.66 35.7,32.72 35.58,32.86 35.38,33.09 35.13,32.98 34.97,32.91 34.79,32.85 34.42,32.76 34.04,32.7 33.64,32.68 33.25,32.7 32.86,32.76 32.49,32.85 32.32,32.91 32.15,32.98 31.91,33.09 31.72,32.87 31.57,32.71 31.5,32.64 31.45,32.67 31.39,32.72 | 31.39,32.72
N$60
  Top 0.254: 32.98,34.17 32.72,34.23 32.5,34.3 32.28,34.38 32.04,34.49 31.81,34.62 31.57,34.79 31.34,34.96 31.18,35.11 31.12,35.18 31.06,35.27 30.95,35.48 30.87,35.71 30.82,35.93 30.82,36.12 30.84,36.36 30.88,36.59 30.93,36.78 30.92,36.8 30.89,36.83 30.76,36.89 30.66,36.93 30.56,36.99 30.46,37.07 30.36,37.16 30.25,37.27 30.16,37.38 30.08,37.5 30.01,37.63 29.91,37.85 29.83,38.13 29.78,38.4 29.76,38.64 29.75,38.72 29.73,38.8 29.69,38.88 29.63,38.95 29.56,39.05 29.55,39.09 29.56,39.12 29.61,39.16 29.68,39.2 29.94,39.33 30.11,39.4 30.26,39.45 30.42,39.48 30.64,39.49 30.98,39.49 31.14,39.48 31.29,39.46 31.43,39.42 31.57,39.38 31.87,39.25 32.17,39.09 32.44,39.23 32.7,39.33 33.02,39.42 33.35,39.48 33.64,39.5 33.94,39.48 34.26,39.42 34.58,39.33 34.85,39.23 35.11,39.09 35.42,39.25 35.71,39.38 35.86,39.42 36,39.46 36.15,39.48 36.3,39.49 36.64,39.49 36.86,39.48 37.03,39.45 37.18,39.4 37.35,39.33 37.61,39.2 37.68,39.16 37.72,39.12 37.74,39.09 37.73,39.05 37.65,38.95 37.6,38.88 37.56,38.8 37.54,38.72 37.53,38.64 37.51,38.4 37.45,38.13 37.37,37.85 37.28,37.63 37.21,37.5 37.12,37.38 37.03,37.27 36.93,37.16 36.83,37.07 36.72,36.99 36.62,36.93 36.53,36.89 36.39,36.83 36.36,36.8 36.36,36.78 36.41,36.59 36.45,36.36 36.47,36.12 36.46,35.93 36.42,35.72 36.34,35.49 36.24,35.28 36.13,35.13 36,35 35.83,34.86 35.63,34.73 35.42,34.6 35.2,34.48 34.97,34.38 34.75,34.29 34.53,34.22 34.37,34.19 34.18,34.16 33.76,34.13 33.33,34.13 33.14,34.15 32.98,34.17
N$61
  Top 0.254: 34.52,34.77 34.62,34.81 34.73,34.87 34.83,34.94 34.91,35 35,35.09 35.05,35.18 35.06,35.29 35.05,35.47 35.04,35.62 35,35.78 34.95,35.93 34.89,36.07 34.82,36.21 34.73,36.34 34.64,36.46 34.53,36.57 34.42,36.67 34.3,36.76 34.18,36.83 34.05,36.89 33.92,36.94 33.79,36.97 33.65,36.98 33.52,36.97 33.4,36.95 33.28,36.91 33.17,36.86 33.06,36.8 32.95,36.73 32.85,36.65 32.66,36.47 32.5,36.25 32.37,36.02 32.32,35.89 32.28,35.76 32.25,35.63 32.24,35.5 32.23,35.36 32.23,35.25 32.25,35.16 32.29,35.09 32.38,34.99 32.53,34.88 32.7,34.8 32.91,34.72 33.07,34.7 33.27,34.68 33.73,34.67 34.19,34.7 34.38,34.73 34.52,34.77
N$62
  Top 0.254: 32.75,35.32 32.72,35.38 32.7,35.44 32.69,35.52 32.7,35.6 32.74,35.78 32.82,35.98 32.91,36.12 33,36.22 33.05,36.24 33.09,36.25 33.13,36.25 33.17,36.24 33.2,36.21 33.23,36.18 33.28,36.07 33.31,35.91 33.31,35.71 33.3,35.56 33.28,35.45 33.23,35.38 33.17,35.31 33.11,35.27 33.05,35.23 32.99,35.21 32.93,35.21 32.88,35.21 32.83,35.23 32.79,35.27 32.75,35.32
N$63
  Top 0.254: 34.1,35.32 34.05,35.39 34.01,35.47 33.99,35.58 33.97,35.72 33.98,35.91 34,36.07 34.05,36.18 34.08,36.22 34.12,36.24 34.16,36.25 34.2,36.25 34.24,36.24 34.29,36.22 34.38,36.12 34.47,35.98 34.55,35.78 34.59,35.6 34.59,35.52 34.58,35.44 34.57,35.38 34.54,35.32 34.5,35.27 34.45,35.23 34.39,35.21 34.34,35.2 34.27,35.21 34.21,35.23 34.16,35.27 34.1,35.32 | 34.1,35.32
N$64
  Top 0.254: 32.34,37.1 32.37,37.12 32.39,37.15 32.41,37.21 32.39,37.29 32.34,37.35 32.3,37.38 32.27,37.39 32.24,37.38 32.2,37.35 32.16,37.29 32.14,37.22 32.15,37.15 32.17,37.12 32.19,37.11 32.26,37.08 32.34,37.1
N$65
  Top 0.254: 35.08,37.1 35.11,37.12 35.13,37.15 35.15,37.21 35.13,37.29 35.08,37.35 35.05,37.38 35.02,37.39 34.98,37.38 34.95,37.35 34.9,37.29 34.88,37.22 34.89,37.15 34.91,37.12 34.94,37.11 35,37.08 35.08,37.1
N$66
  Top 0.254: 31.94,39.45 31.72,39.58 32.08,39.74 32.38,39.87 32.67,39.97 32.96,40.03 33.27,40.08 33.42,40.1 33.52,40.12 33.57,40.16 33.6,40.22 33.63,40.3 33.63,40.35 33.59,40.38 33.5,40.42 33.4,40.47 33.32,40.53 33.26,40.61 33.22,40.69 33.19,40.78 33.2,40.86 33.22,40.94 33.28,41.01 33.36,41.07 33.46,41.09 33.56,41.08 33.65,41.05 33.74,40.98 33.81,40.9 33.86,40.8 33.87,40.69 33.88,40.61 33.9,40.57 33.94,40.56 34.03,40.55 34.09,40.55 34.15,40.53 34.19,40.51 34.21,40.48 34.22,40.41 34.22,40.38 34.2,40.36 34.14,40.33 34.03,40.32 33.94,40.31 33.88,40.28 33.84,40.22 33.83,40.14 33.85,40.13 33.9,40.11 34.08,40.07 34.37,40.03 34.65,39.96 34.93,39.86 35.21,39.74 35.56,39.58 35.34,39.45 35.11,39.33 34.85,39.46 34.58,39.56 34.29,39.64 33.98,39.69 33.66,39.7 33.34,39.69 33.02,39.64 32.73,39.57 32.45,39.46 32.18,39.34 32.1,39.37 31.94,39.45
N$67
  Top 0.254: 33.59,40.81 33.54,40.85 33.48,40.87 33.45,40.87 33.43,40.85 33.42,40.83 33.42,40.8 33.45,40.73 33.52,40.67 33.57,40.63 33.61,40.62 33.62,40.63 33.63,40.67 33.63,40.74 33.59,40.81 | 33.59,40.81
N$68
  Top 0: 7.37,2.74 7.29,2.79 7.23,2.86 7.18,2.93 7.15,3 7.14,3.05 7.12,3.06 7.11,3.06 7.12,3.08 7.12,3.14 7.1,3.23 7.08,3.35 7.07,3.46 7.07,3.54 7.07,3.56 7.06,3.56 7.05,3.55 7.04,3.52 7.04,3.4 7.04,3.29 7.04,3.24 7.02,3.21 7.01,3.13 6.99,3.02 6.94,2.92 6.88,2.82 6.81,2.75 6.75,2.73 6.69,2.71 6.63,2.71 6.57,2.71 6.51,2.73 6.46,2.76 6.42,2.8 6.38,2.85 6.35,2.93 6.34,3 6.34,3.08 6.35,3.16 6.37,3.25 6.4,3.33 6.51,3.53 6.61,3.7 6.67,3.88 6.7,4.02 6.69,4.06 6.67,4.08 6.66,4.08 6.67,4.1 6.69,4.11 6.7,4.13 6.68,4.21 6.66,4.26 6.64,4.28 6.62,4.29 6.6,4.32 6.57,4.37 6.58,4.32 6.59,4.22 6.59,4.1 6.58,3.98 6.56,3.88 6.52,3.82 6.48,3.76 6.42,3.71 6.36,3.67 6.3,3.64 6.22,3.62 6.14,3.61 6.05,3.61 5.98,3.62 5.91,3.65 5.85,3.68 5.79,3.72 5.75,3.77 5.71,3.82 5.65,3.94 5.63,4.08 5.63,4.15 5.64,4.22 5.66,4.29 5.69,4.35 5.73,4.42 5.78,4.48 5.87,4.55 5.98,4.62 6.1,4.66 6.24,4.7 6.38,4.71 6.52,4.71 6.67,4.7 6.81,4.67 7.18,4.56 7.44,4.49 7.72,4.45 7.93,4.42 8.04,4.4 8.11,4.34 8.16,4.26 8.19,4.17 8.18,4.12 8.17,4.08 8.14,4.02 8.09,3.97 8.03,3.94 7.96,3.91 7.88,3.9 7.8,3.9 7.72,3.92 7.64,3.95 7.6,3.96 7.56,3.96 7.54,3.96 7.54,3.97 7.53,3.99 7.49,4.02 7.42,4.04 7.41,4.04 7.4,4.02 7.38,3.96 7.39,3.86 7.42,3.74 7.46,3.61 7.52,3.48 7.58,3.36 7.63,3.28 7.65,3.26 7.66,3.25 7.67,3.25 7.67,3.24 7.67,3.19 7.69,3.12 7.72,3 7.72,2.9 7.71,2.82 7.67,2.75 7.61,2.71 7.54,2.69 7.46,2.7 7.37,2.74
N$69
  Top 0: 7.1,3.78 | 7.1,3.78 7.1,3.91 7.09,4.02 7.07,4.11 7.03,4.17 7.01,4.2 7,4.17 7.04,3.83 7.06,3.65 7.06,3.6 7.07,3.59 7.1,3.78
N$70
  Top 0: 7.06,3.85 7.07,3.88 7.08,3.87 7.08,3.84 7.07,3.83 7.06,3.85
N$71
  Top 0: 7.27,5.38 7.19,5.38 7.19,5.84 7.18,6.17 7.17,6.31 7.14,6.3 7.09,6.25 7.07,6.21 7.05,6.17 7.04,6.02 7.04,5.93 7.03,5.88 7.01,5.83 6.98,5.78 6.93,5.71 6.93,5.67 6.93,5.66 6.92,5.67 6.9,5.67 6.86,5.64 6.82,5.62 6.78,5.6 6.55,5.6 6.29,5.61 6.29,6.42 6.3,7 6.31,7.24 6.42,7.38 6.51,7.5 6.72,7.5 6.89,7.5 6.97,7.49 7,7.44 7.05,7.36 7.1,7.28 7.13,7.26 7.14,7.26 7.14,7.24 7.14,7.21 7.16,7.17 7.18,7.15 7.19,7.14 7.23,7.18 7.26,7.22 7.26,7.25 7.26,7.26 7.27,7.26 7.31,7.29 7.38,7.37 7.48,7.49 7.95,7.49 7.96,6.56 7.95,5.76 7.94,5.63 7.92,5.58 7.81,5.45 7.74,5.36 7.55,5.36 7.27,5.38 | 7.27,5.38
N$72
  Top 0: 7.88,6.56 7.88,7.42 7.52,7.42 7.46,7.32 7.42,7.24 7.42,7.2 7.42,7.18 7.41,7.19 7.39,7.18 7.37,7.16 7.32,7.07 7.23,6.92 7.22,6.92 7.2,6.93 7.16,7.01 7.11,7.08 7.09,7.1 7.08,7.1 7.06,7.1 7.07,7.11 7.06,7.16 7.01,7.26 6.96,7.34 6.9,7.39 6.81,7.41 6.67,7.41 6.57,7.42 6.57,6.68 6.58,5.95 6.77,5.94 6.95,5.94 6.96,6.41 6.96,6.91 6.97,6.96 7.01,6.92 7.1,6.79 7.21,6.6 7.25,6.65 7.38,6.84 7.48,6.98 7.48,6.34 7.49,5.7 7.88,5.7 7.88,6.56 | 7.88,6.56
N$73
  Top 0: 1.89,5.55 1.88,5.73 1.88,6.15 1.88,6.61 1.89,6.95 1.91,7.16 2.01,7.28 2.11,7.41 2.42,7.43 2.72,7.45 3.01,7.46 3.29,7.46 3.29,6.79 3.23,6.71 3.16,6.64 3.21,6.6 3.27,6.56 3.29,6.44 3.3,6.18 3.3,5.81 3.24,5.75 3.2,5.69 3.2,5.66 3.2,5.64 3.17,5.64 3.12,5.61 3.08,5.58 3,5.56 2.49,5.54 2.08,5.54 1.89,5.55 | 1.89,5.55
N$74
  Top 0: 3.21,5.93 3.22,5.94 3.21,5.96 3.2,6.04 3.2,6.22 3.21,6.49 3.08,6.54 2.98,6.59 2.96,6.61 2.96,6.63 3,6.67 3.09,6.75 3.21,6.84 3.21,7.37 2.83,7.36 2.32,7.34 2.18,7.32 2.18,6.62 2.18,5.89 2.22,5.88 2.34,5.88 2.69,5.89 3.04,5.91 3.16,5.92 3.21,5.93
N$75
  Top 0: 2.58,6.25 2.58,6.49 2.59,6.51 2.6,6.53 2.7,6.53 2.81,6.53 2.82,6.37 2.82,6.22 2.71,6.22 2.61,6.22 2.59,6.24 2.58,6.25 | 2.58,6.25
N$76
  Top 0: 2.73,6.71 2.65,6.72 2.58,6.72 2.57,6.88 2.56,7.03 2.69,7.03 2.81,7.02 2.82,6.9 2.82,6.81 2.81,6.75 2.8,6.71 2.77,6.7 2.73,6.71
N$77
  Top 0: 10.86,5.58 10.85,5.67 10.84,5.84 10.83,6.49 10.83,7.16 10.93,7.3 11.03,7.44 11.28,7.44 11.82,7.42 12.11,7.41 12.11,6.91 11.97,6.76 11.9,6.68 11.85,6.62 11.84,6.58 11.83,6.52 11.82,6.43 11.79,6.38 11.77,6.34 11.76,6.32 11.77,6.3 11.76,6.31 11.73,6.3 11.67,6.26 11.63,6.21 11.61,6.17 11.6,6.11 11.6,5.99 11.6,5.8 11.51,5.71 11.46,5.64 11.44,5.6 11.44,5.58 11.43,5.58 11.41,5.59 11.4,5.58 11.37,5.56 11.31,5.56 11.12,5.55 10.95,5.56 10.89,5.57 10.86,5.58
N$78
  Top 0: 11.52,6.19 11.52,6.51 11.64,6.51 11.72,6.52 11.74,6.53 11.75,6.54 11.76,6.61 11.76,6.64 11.74,6.67 11.7,6.69 11.65,6.69 11.58,6.69 11.54,6.7 11.52,6.74 11.5,6.8 11.49,6.88 11.5,6.94 11.51,7 11.76,6.99 11.96,6.99 12.01,7 12.03,7.01 12.03,7.06 12.03,7.17 12.03,7.27 12.02,7.32 11.56,7.34 11.1,7.36 11.11,6.77 11.12,6.04 11.13,5.9 11.22,5.89 11.41,5.88 11.51,5.87 11.52,6.19
N$79
  Top 0: 3.36,6.17 3.35,6.64 3.34,6.75 3.33,6.78 3.32,6.79 3.33,6.79 3.34,6.8 3.35,6.84 3.36,6.99 3.36,7.19 3.47,7.33 3.57,7.47 3.83,7.49 4.02,7.5 4.1,7.49 4.11,7.24 4.12,6.66 4.12,5.84 4.06,5.79 3.96,5.67 3.92,5.63 3.88,5.61 3.79,5.6 3.63,5.59 3.36,5.58 3.36,6.17
N$80
  Top 0: 4.04,6.67 4.04,7.13 4.04,7.27 4.02,7.35 4,7.4 3.95,7.41 3.81,7.4 3.65,7.38 3.65,7.22 3.65,6.5 3.66,5.94 4.04,5.94 4.04,6.67
N$81
  Top 0: 9.73,5.59 9.5,5.6 9.5,6.13 9.5,6.93 9.5,7.2 9.61,7.34 9.72,7.49 10.21,7.47 10.74,7.45 10.76,7.43 10.78,7.4 10.79,7.22 10.79,6.98 10.74,6.92 10.66,6.83 10.58,6.75 10.53,6.71 10.52,6.7 10.51,6.68 10.51,6.6 10.5,6.54 10.49,6.49 10.45,6.43 10.39,6.36 10.27,6.22 10.27,6.04 10.27,5.89 10.25,5.85 10.24,5.83 10.22,5.81 10.22,5.79 10.22,5.77 10.21,5.77 10.2,5.76 10.2,5.74 10.2,5.73 10.17,5.73 10.15,5.72 10.14,5.7 10.14,5.68 10.14,5.66 10.13,5.67 10.1,5.67 10.08,5.64 10.04,5.61 9.99,5.59 9.89,5.59 9.73,5.59 | 9.73,5.59
N$82
  Top 0: 10.19,6.24 10.19,6.56 10.42,6.56 10.42,6.72 10.31,6.74 10.19,6.76 10.18,6.91 10.18,7.04 10.44,7.03 10.7,7.03 10.7,7.2 10.69,7.33 10.69,7.36 10.67,7.37 10.22,7.38 9.8,7.4 9.79,7.35 9.78,7.12 9.78,6.62 9.79,5.95 9.84,5.94 10.04,5.92 10.19,5.92 10.19,6.24 | 10.19,6.24
N$83
  Top 0: 8.07,5.61 8.06,5.65 8.05,5.79 8.05,6.41 8.05,7.21 8.15,7.35 8.26,7.5 8.37,7.49 8.64,7.48 8.79,7.48 8.8,7.41 8.8,7.36 8.81,7.36 8.81,7.37 8.82,7.4 8.82,7.43 8.82,7.45 8.83,7.45 8.85,7.45 8.87,7.46 8.95,7.47 9.15,7.48 9.42,7.48 9.42,7.35 9.42,7.26 9.44,7.21 9.45,7.2 9.45,7.18 9.44,6.97 9.44,6.51 9.43,5.97 9.42,5.87 9.4,5.83 9.38,5.79 9.29,5.69 9.2,5.59 8.65,5.6 8.07,5.61 | 8.07,5.61
N$84
  Top 0: 9.35,6.66 9.34,7.38 9.15,7.39 8.99,7.39 8.97,7.37 8.96,7.35 8.96,6.79 8.96,6.29 8.72,6.29 8.71,6.84 8.71,7.39 8.59,7.4 8.39,7.4 8.32,7.39 8.32,6.67 8.33,6.14 8.34,6.01 8.35,5.97 8.36,5.97 8.37,5.96 8.4,5.95 8.49,5.94 8.86,5.94 9.35,5.94 9.35,6.66 | 9.35,6.66
N$85
  Top 0: 4.18,5.79 4.18,5.92 4.17,5.97 4.16,5.99 4.15,6.03 4.16,6.06 4.17,6.02 4.17,6.03 4.18,6.05 4.18,6.17 4.18,6.59 4.18,7.21 4.3,7.36 4.41,7.5 4.98,7.5 5.56,7.5 5.57,7.43 5.58,7.27 5.59,7.04 5.51,6.93 5.43,6.81 5.46,6.8 5.51,6.79 5.59,6.79 5.58,6.3 5.58,5.96 5.56,5.82 5.53,5.79 5.47,5.74 5.42,5.67 5.39,5.63 5.31,5.62 5.1,5.62 4.9,5.62 4.84,5.63 4.82,5.64 4.82,5.66 4.8,5.67 4.75,5.67 4.71,5.65 4.6,5.62 4.4,5.62 4.16,5.62 4.18,5.79 | 4.18,5.79
N$86
  Top 0: 4.97,6.01 5.11,6.07 5.11,6.01 5.11,5.96 5.31,5.96 5.46,5.97 5.5,5.99 5.51,6 5.5,6.37 5.5,6.71 5.27,6.71 5.04,6.7 5.03,6.62 5.04,6.56 5.05,6.54 5.07,6.53 5.09,6.52 5.11,6.5 5.11,6.42 5.1,6.31 4.98,6.31 4.86,6.3 4.86,6.69 4.87,7.08 5.1,7.08 5.11,7 5.12,6.94 5.13,6.93 5.14,6.93 5.34,7.01 5.5,7.08 5.5,7.42 4.47,7.42 4.47,5.94 4.66,5.95 4.83,5.96 4.97,6.01 | 4.97,6.01
N$87
  Top 0: 9.46,5.89 9.46,5.91 9.47,5.9 9.48,5.88 9.47,5.86 9.46,5.86 9.46,5.89
VCC
  Top 1.676: SWITCH.2 LED.4
  Bottom 0.813: R16.2 31.75,50.8
  Bottom 1.676: R5.2 R11.2 31.75,25.4 31.75,50.8 31.75,57.15 | 31.75,57.15 36.83,57.15 | 36.83,57.15 R22.2 | R21.2 40.64,77.47 36.83,73.66 36.83,57.15 | LED.4 C16.2 31.75,57.15

## Text on the board
Top: Distortion Pedal / J.Rodriguez / 07/01/2015